# Altium schematic sheet nextion.SchDoc
size A4; SheetNumber: 9; SheetTotal: 10
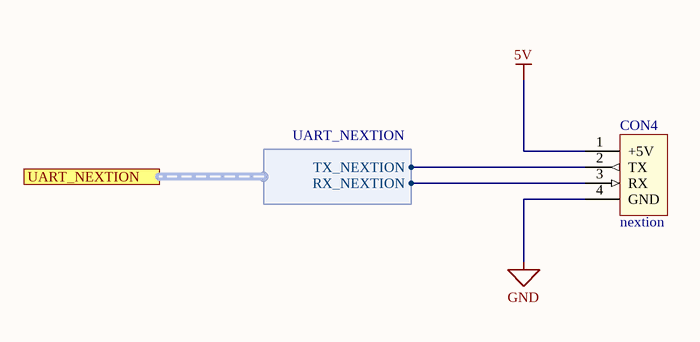
[diagram p0: nextion.SchDoc]

## Parts
CON4  nextion

## Ports
UART_NEXTION (harness UART_NEXTION)

## Harnesses
UART_NEXTION: TX_NEXTION, RX_NEXTION

## Nets
5V: CON4.1(+5V)
GND: CON4.4(GND)
NetCON4_2: CON4.2(TX) ; port UART_NEXTION.TX_NEXTION
NetCON4_3: CON4.3(RX) ; port UART_NEXTION.RX_NEXTION